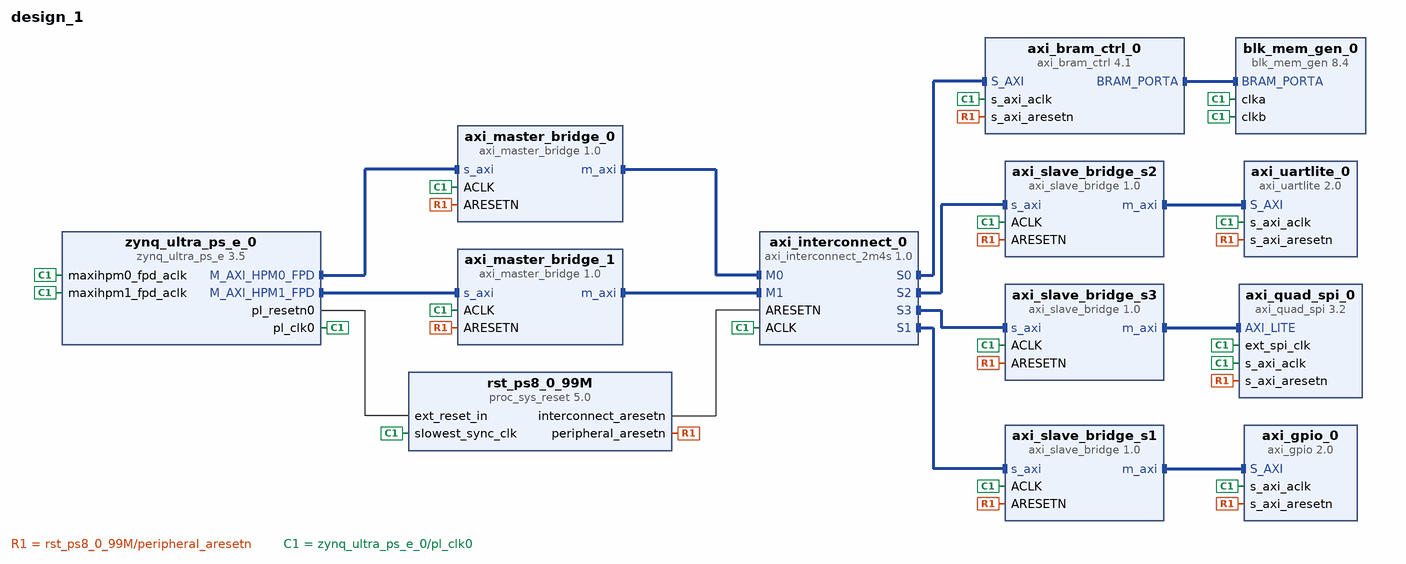
[diagram p0: block diagram of the top level]
# Vivado block design design_1, xczu5ev-sfvc784-1-e, Vivado 2024.2
create_bd_design design_1

create_bd_cell -type ip -vlnv xilinx.com:ip:zynq_ultra_ps_e:3.5 zynq_ultra_ps_e_0
set_property -dict [list \
  CONFIG.PSU__CRL_APB__PL0_REF_CTRL__FREQMHZ 100 \
  CONFIG.PSU__DDR_HIGH_ADDRESS_GUI_ENABLE 0 \
  CONFIG.PSU__FPGA_PL0_ENABLE 1 \
  CONFIG.PSU__MAXIGP0__DATA_WIDTH 32 \
  CONFIG.PSU__MAXIGP1__DATA_WIDTH 32 \
  CONFIG.PSU__USE__M_AXI_GP0 1 \
  CONFIG.PSU__USE__M_AXI_GP1 1 \
  CONFIG.PSU__USE__M_AXI_GP2 0 \
] [get_bd_cells zynq_ultra_ps_e_0]
# 27 more settings of zynq_ultra_ps_e_0 are not shown: defaults, MIO pin electricals, DDR timing, and values the tool derives
create_bd_cell -type ip -vlnv user.org:user:axi_master_bridge:1.0 axi_master_bridge_0
set_property -dict {CONFIG.DATA_WIDTH 32} [get_bd_cells axi_master_bridge_0]
create_bd_cell -type ip -vlnv user.org:user:axi_master_bridge:1.0 axi_master_bridge_1
set_property -dict {CONFIG.DATA_WIDTH 32} [get_bd_cells axi_master_bridge_1]
create_bd_cell -type ip -vlnv user.org:user:axi_interconnect_2m4s:1.0 axi_interconnect_0
create_bd_cell -type ip -vlnv xilinx.com:ip:proc_sys_reset:5.0 rst_ps8_0_99M
create_bd_cell -type ip -vlnv user.org:user:axi_slave_bridge:1.0 axi_slave_bridge_s2
set_property -dict {CONFIG.ADDR_WIDTH 32 CONFIG.DATA_WIDTH 32} [get_bd_cells axi_slave_bridge_s2]
create_bd_cell -type ip -vlnv xilinx.com:ip:axi_uartlite:2.0 axi_uartlite_0
set_property -dict {CONFIG.C_BAUDRATE 115200 CONFIG.C_S_AXI_ACLK_FREQ_HZ 99999001} [get_bd_cells axi_uartlite_0]
create_bd_cell -type ip -vlnv user.org:user:axi_slave_bridge:1.0 axi_slave_bridge_s3
set_property -dict {CONFIG.ADDR_WIDTH 32 CONFIG.DATA_WIDTH 32} [get_bd_cells axi_slave_bridge_s3]
create_bd_cell -type ip -vlnv xilinx.com:ip:axi_quad_spi:3.2 axi_quad_spi_0
set_property -dict {CONFIG.C_NUM_SS_BITS 1 CONFIG.C_USE_STARTUP 0} [get_bd_cells axi_quad_spi_0]
create_bd_cell -type ip -vlnv user.org:user:axi_slave_bridge:1.0 axi_slave_bridge_s1
set_property -dict {CONFIG.ADDR_WIDTH 32 CONFIG.DATA_WIDTH 32} [get_bd_cells axi_slave_bridge_s1]
create_bd_cell -type ip -vlnv xilinx.com:ip:axi_gpio:2.0 axi_gpio_0
set_property -dict {CONFIG.C_ALL_INPUTS 0 CONFIG.C_ALL_OUTPUTS 0 CONFIG.C_GPIO_WIDTH 32} [get_bd_cells axi_gpio_0]
create_bd_cell -type ip -vlnv xilinx.com:ip:axi_bram_ctrl:4.1 axi_bram_ctrl_0
set_property -dict {CONFIG.DATA_WIDTH 32 CONFIG.PROTOCOL AXI4 CONFIG.SINGLE_PORT_BRAM 1} [get_bd_cells axi_bram_ctrl_0]
create_bd_cell -type ip -vlnv xilinx.com:ip:blk_mem_gen:8.4 blk_mem_gen_0
set_property -dict [list \
  CONFIG.Enable_B Use_ENB_Pin \
  CONFIG.Memory_Type True_Dual_Port_RAM \
  CONFIG.Read_Width_A 32 \
  CONFIG.Read_Width_B 32 \
  CONFIG.Write_Width_A 32 \
  CONFIG.Write_Width_B 32 \
  CONFIG.use_bram_block BRAM_Controller \
] [get_bd_cells blk_mem_gen_0]

# ---- connections ----

connect_bd_intf_net [get_bd_intf_pins axi_bram_ctrl_0/BRAM_PORTA] [get_bd_intf_pins blk_mem_gen_0/BRAM_PORTA]
connect_bd_intf_net [get_bd_intf_pins axi_interconnect_0/S0] [get_bd_intf_pins axi_bram_ctrl_0/S_AXI]
connect_bd_intf_net [get_bd_intf_pins axi_interconnect_0/S1] [get_bd_intf_pins axi_slave_bridge_s1/s_axi]
connect_bd_intf_net [get_bd_intf_pins axi_interconnect_0/S2] [get_bd_intf_pins axi_slave_bridge_s2/s_axi]
connect_bd_intf_net [get_bd_intf_pins axi_interconnect_0/S3] [get_bd_intf_pins axi_slave_bridge_s3/s_axi]
connect_bd_intf_net [get_bd_intf_pins axi_master_bridge_0/m_axi] [get_bd_intf_pins axi_interconnect_0/M0]
connect_bd_intf_net [get_bd_intf_pins axi_master_bridge_1/m_axi] [get_bd_intf_pins axi_interconnect_0/M1]
connect_bd_intf_net [get_bd_intf_pins axi_slave_bridge_s1/m_axi] [get_bd_intf_pins axi_gpio_0/S_AXI]
connect_bd_intf_net [get_bd_intf_pins axi_slave_bridge_s2/m_axi] [get_bd_intf_pins axi_uartlite_0/S_AXI]
connect_bd_intf_net [get_bd_intf_pins axi_slave_bridge_s3/m_axi] [get_bd_intf_pins axi_quad_spi_0/AXI_LITE]
connect_bd_intf_net [get_bd_intf_pins zynq_ultra_ps_e_0/M_AXI_HPM0_FPD] [get_bd_intf_pins axi_master_bridge_0/s_axi]
connect_bd_intf_net [get_bd_intf_pins zynq_ultra_ps_e_0/M_AXI_HPM1_FPD] [get_bd_intf_pins axi_master_bridge_1/s_axi]
connect_bd_net [get_bd_pins rst_ps8_0_99M/interconnect_aresetn] [get_bd_pins axi_interconnect_0/ARESETN]
connect_bd_net [get_bd_pins rst_ps8_0_99M/peripheral_aresetn] \
  [get_bd_pins axi_uartlite_0/s_axi_aresetn] [get_bd_pins axi_quad_spi_0/s_axi_aresetn] \
  [get_bd_pins axi_gpio_0/s_axi_aresetn] [get_bd_pins axi_bram_ctrl_0/s_axi_aresetn] \
  [get_bd_pins axi_master_bridge_0/ARESETN] [get_bd_pins axi_master_bridge_1/ARESETN] \
  [get_bd_pins axi_slave_bridge_s1/ARESETN] [get_bd_pins axi_slave_bridge_s2/ARESETN] \
  [get_bd_pins axi_slave_bridge_s3/ARESETN]
connect_bd_net [get_bd_pins zynq_ultra_ps_e_0/pl_clk0] \
  [get_bd_pins rst_ps8_0_99M/slowest_sync_clk] [get_bd_pins axi_interconnect_0/ACLK] [get_bd_pins axi_uartlite_0/s_axi_aclk] \
  [get_bd_pins axi_quad_spi_0/ext_spi_clk] [get_bd_pins axi_quad_spi_0/s_axi_aclk] \
  [get_bd_pins zynq_ultra_ps_e_0/maxihpm0_fpd_aclk] [get_bd_pins zynq_ultra_ps_e_0/maxihpm1_fpd_aclk] \
  [get_bd_pins axi_gpio_0/s_axi_aclk] [get_bd_pins axi_bram_ctrl_0/s_axi_aclk] [get_bd_pins blk_mem_gen_0/clka] \
  [get_bd_pins blk_mem_gen_0/clkb] [get_bd_pins axi_master_bridge_0/ACLK] [get_bd_pins axi_master_bridge_1/ACLK] \
  [get_bd_pins axi_slave_bridge_s1/ACLK] [get_bd_pins axi_slave_bridge_s2/ACLK] [get_bd_pins axi_slave_bridge_s3/ACLK]
connect_bd_net [get_bd_pins zynq_ultra_ps_e_0/pl_resetn0] [get_bd_pins rst_ps8_0_99M/ext_reset_in]

# ---- address map ----
assign_bd_address -offset 0x00000000 -range 64K -target_address_space [get_bd_addr_spaces axi_interconnect_0/S0] [get_bd_addr_segs axi_bram_ctrl_0/S_AXI/Mem0]
assign_bd_address -offset 0x40000000 -range 512M -target_address_space [get_bd_addr_spaces axi_interconnect_0/S1] [get_bd_addr_segs axi_slave_bridge_s1/s_axi/reg0]
assign_bd_address -offset 0x80000000 -range 512M -target_address_space [get_bd_addr_spaces axi_interconnect_0/S2] [get_bd_addr_segs axi_slave_bridge_s2/s_axi/reg0]
assign_bd_address -offset 0xC0000000 -range 512M -target_address_space [get_bd_addr_spaces axi_interconnect_0/S3] [get_bd_addr_segs axi_slave_bridge_s3/s_axi/reg0]
assign_bd_address -offset 0x00000000 -range 4G -target_address_space [get_bd_addr_spaces axi_master_bridge_0/m_axi] [get_bd_addr_segs axi_interconnect_0/M0/reg0]
assign_bd_address -offset 0x00000000 -range 4G -target_address_space [get_bd_addr_spaces axi_master_bridge_1/m_axi] [get_bd_addr_segs axi_interconnect_0/M1/reg0]
assign_bd_address -offset 0x40000000 -range 64K -target_address_space [get_bd_addr_spaces axi_slave_bridge_s1/m_axi] [get_bd_addr_segs axi_gpio_0/S_AXI/Reg]
assign_bd_address -offset 0x40600000 -range 64K -target_address_space [get_bd_addr_spaces axi_slave_bridge_s2/m_axi] [get_bd_addr_segs axi_uartlite_0/S_AXI/Reg]
assign_bd_address -offset 0x44A00000 -range 64K -target_address_space [get_bd_addr_spaces axi_slave_bridge_s3/m_axi] [get_bd_addr_segs axi_quad_spi_0/AXI_LITE/Reg]
assign_bd_address -offset 0x0400000000 -range 4G -target_address_space [get_bd_addr_spaces zynq_ultra_ps_e_0/Data] [get_bd_addr_segs axi_master_bridge_0/s_axi/reg0]
assign_bd_address -offset 0x0500000000 -range 4G -target_address_space [get_bd_addr_spaces zynq_ultra_ps_e_0/Data] [get_bd_addr_segs axi_master_bridge_1/s_axi/reg0]

validate_bd_design
save_bd_design
